# Altium schematic sheet blackfin_b_flash_jtag_serial.SchDoc: Flash, JTAG, RS-232
size A3; SheetNumber: 2; SheetTotal: 6
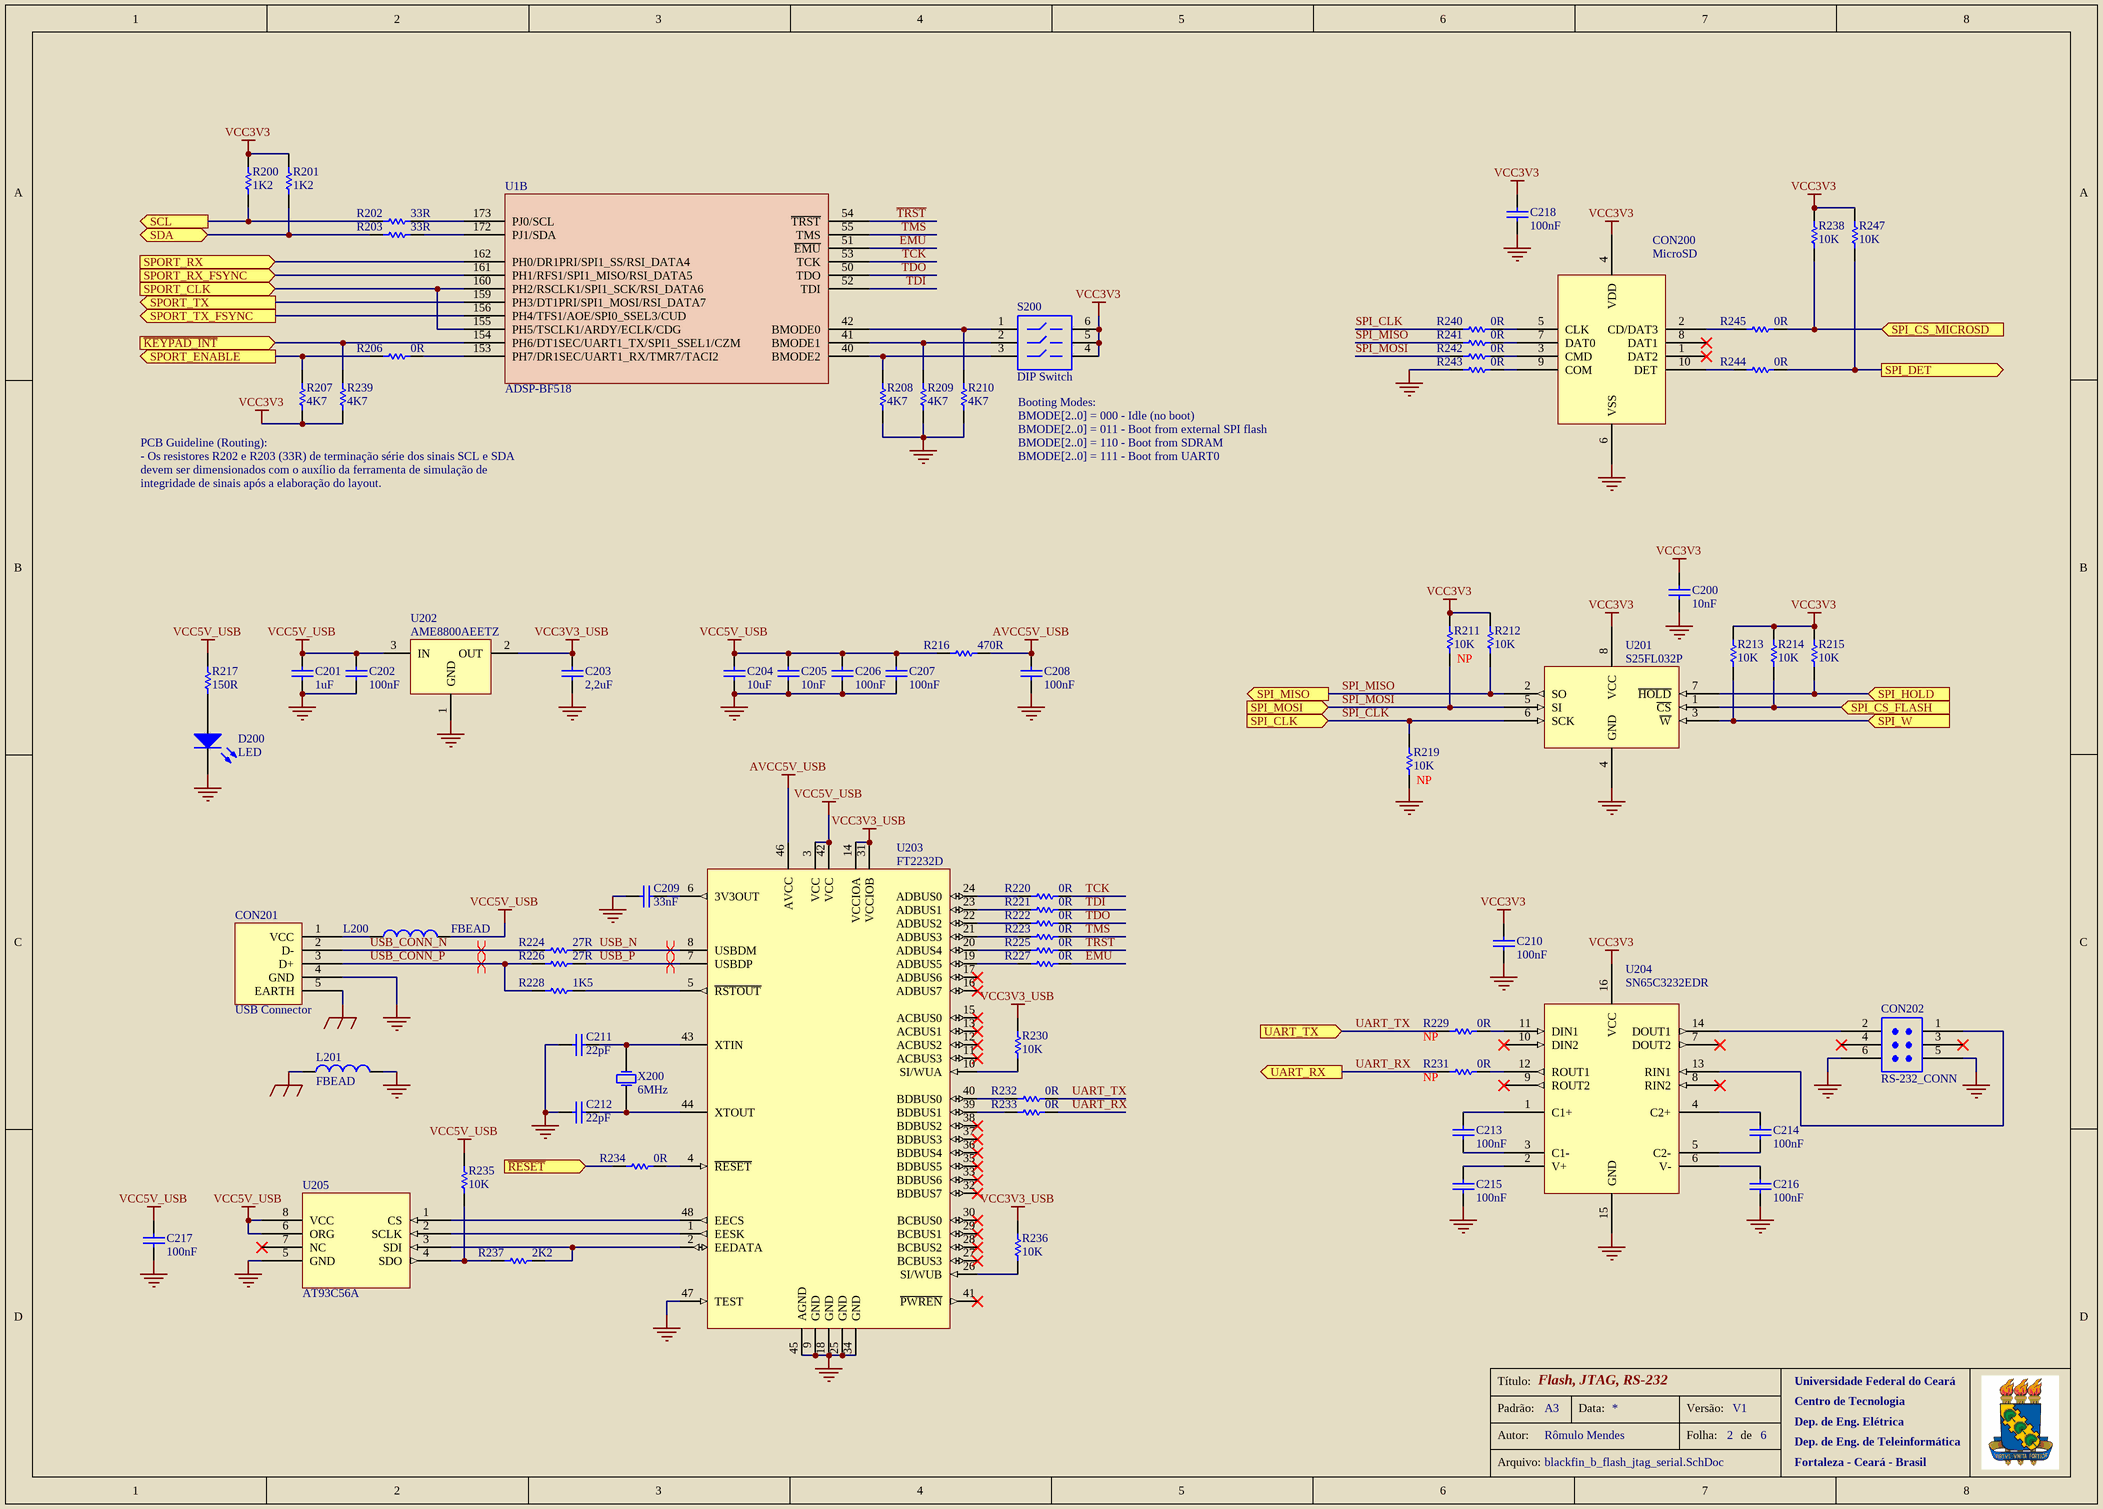
[diagram p0: blackfin_b_flash_jtag_serial.SchDoc]

## Parts
C200  10nF  [C_0603]
C201  1uF  [C_0603]
C202  100nF  [C_0603]
C203  2,2uF  [C_0603]
C204  10uF  [C_0805]
C205  10nF  [C_0603]
C206  100nF  [C_0603]
C207  100nF  [C_0603]
C208  100nF  [C_0603]
C209  33nF  [C_0603]
C210  100nF  [C_0603]
C211  22pF  [C_0603]
C212  22pF  [C_0603]
C213  100nF  [C_0603]
C214  100nF  [C_0603]
C215  100nF  [C_0603]
C216  100nF  [C_0603]
C217  100nF  [C_0603]
C218  100nF  [C_0603]
CON200  MicroSD  [MICRO_SD]
CON201  USB Connector  [USB Connector]
CON202  RS-232_CONN  [Header_2x3]
D200  LED  [LED_0603]
L200  FBEAD  [L_0603]
L201  FBEAD  [L_0603]
R200  1K2  [R_0603]
R201  1K2  [R_0603]
R202  33R  [R_0402]
R203  33R  [R_0402]
R206  0R  [R_0603]
R207  4K7  [R_0603]
R208  4K7  [R_0603]
R209  4K7  [R_0603]
R210  4K7  [R_0603]
R211  10K  [R_0603]
R212  10K  [R_0603]
R213  10K  [R_0603]
R214  10K  [R_0603]
R215  10K  [R_0603]
R216  470R  [R_0603]
R217  150R  [R_0603]
R219  10K  [R_0603]
R220  0R  [R_0603]
R221  0R  [R_0603]
R222  0R  [R_0603]
R223  0R  [R_0603]
R224  27R  [R_0603]
R225  0R  [R_0603]
R226  27R  [R_0603]
R227  0R  [R_0603]
R228  1K5  [R_0603]
R229  0R  [R_0603]
R230  10K  [R_0603]
R231  0R  [R_0603]
R232  0R  [R_0603]
R233  0R  [R_0603]
R234  0R  [R_0603]
R235  10K  [R_0603]
R236  10K  [R_0603]
R237  2K2  [R_0603]
R238  10K  [R_0603]
R239  4K7  [R_0603]
R240  0R  [R_0603]
R241  0R  [R_0603]
R242  0R  [R_0603]
R243  0R  [R_0603]
R244  0R  [R_0603]
R245  0R  [R_0603]
R247  10K  [R_0603]
S200  DIP Switch  [DIP Switch]
U1  ADSP-BF518  [LQFP-176]  (part B of 4)
U201  S25FL032P  [SO-8]
U202  AME8800AEETZ  [SOT-23]
U203  FT2232D  [LQFP-48]
U204  SN65C3232EDR  [SOIC-16]
U205  AT93C56A  [SOIC-8 (AT93C56A)]
X200  6MHz  [XTAL_6MHz]

## Ports
SCL (out), SDA (bidir), SPI_CLK (in), SPI_CS_FLASH (in), SPI_CS_MICROSD (in), SPI_DET (out), SPI_HOLD (in), SPI_MISO (out), SPI_MOSI (in), SPI_W (in), SPORT_CLK (in), SPORT_ENABLE (out), SPORT_RX (in), SPORT_RX_FSYNC (in), SPORT_TX (out), SPORT_TX_FSYNC (out), UART_RX (out), UART_TX (in), ~{KEYPAD_INT} (in), ~{RESET} (in)

## Nets
AVCC5V_USB: C208.2 R216.2 U203.46(AVCC)
EARTH_USB: CON201.5(EARTH) L201.1
GND: C200.1 C201.1 C202.1 C203.1 C204.1 C205.1 C206.1 C207.1 C208.1 C209.2 C210.1 C211.2 C212.2 C215.1 C216.1 C217.1 C218.1 CON200.6(VSS) CON201.4(GND) CON202.5(GND) CON202.6(GND) D200.2(K) L201.2 R208.1 R209.1 R210.1 R219.1 R243.1 U201.4(GND) U202.1(GND) U203.9(GND) U203.18(GND) U203.25(GND) U203.34(GND) U203.45(AGND) U203.47(TEST) U204.15(GND) U205.5(GND)
VCC3V3: C200.2 C210.2 C218.2 CON200.4(VDD) R200.2 R201.2 R207.1 R211.2 R212.2 R213.2 R214.2 R215.2 R238.2 R239.1 R247.2 S200.4 S200.5 S200.6 U201.8(VCC) U204.16(VCC)
VCC3V3_USB: C203.2 R230.1 R236.1 U202.2(OUT) U203.14(VCCIOA) U203.31(VCCIOB)
VCC5V_USB: C201.2 C202.2 C204.2 C205.2 C206.2 C207.2 C217.2 L200.2 R216.1 R217.2 R235.2 U202.3(IN) U203.3(VCC) U203.42(VCC) U205.6(ORG) U205.8(VCC)
~{EMU}: R227.2 U1.51(~{EMU})
~{KEYPAD_INT}: R239.2 U1.154(PH6/DT1SEC/UART1_TX/SPI1_SSEL1/CZM) ; port ~{KEYPAD_INT}
~{RESET}: R234.1 ; port ~{RESET}
SCL: R200.1 R202.1 ; port SCL
SDA: R201.1 R203.1 ; port SDA
SPI_CLK: R219.2 R240.1 U201.6(SCK) ; port SPI_CLK
SPI_CS_FLASH: R214.1 U201.1(~{CS}) ; port SPI_CS_FLASH
SPI_CS_MICROSD: R238.1 R245.2 ; port SPI_CS_MICROSD
SPI_DET: R244.2 R247.1 ; port SPI_DET
SPI_HOLD: R215.1 U201.7(~{HOLD}) ; port SPI_HOLD
SPI_MISO: R212.1 R241.1 U201.2(SO) ; port SPI_MISO
SPI_MOSI: R211.1 R242.1 U201.5(SI) ; port SPI_MOSI
SPI_W: R213.1 U201.3(~{W}) ; port SPI_W
SPORT_CLK: U1.155(PH5/TSCLK1/ARDY/ECLK/CDG) U1.160(PH2/RSCLK1/SPI1_SCK/RSI_DATA6) ; port SPORT_CLK
SPORT_ENABLE: R206.1 R207.2 ; port SPORT_ENABLE
SPORT_RX: U1.162(PH0/DR1PRI/SPI1_SS/RSI_DATA4) ; port SPORT_RX
SPORT_RX_FSYNC: U1.161(PH1/RFS1/SPI1_MISO/RSI_DATA5) ; port SPORT_RX_FSYNC
SPORT_TX: U1.159(PH3/DT1PRI/SPI1_MOSI/RSI_DATA7) ; port SPORT_TX
SPORT_TX_FSYNC: U1.156(PH4/TFS1/AOE/SPI0_SSEL3/CUD) ; port SPORT_TX_FSYNC
~{TRST}: R225.2 U1.54(~{TRST})
TCK: R220.2 U1.53(TCK)
TDI: R221.2 U1.52(TDI)
TDO: R222.2 U1.50(TDO)
TMS: R223.2 U1.55(TMS)
UART_RX: R231.1 R233.2 ; port UART_RX
UART_TX: R229.1 R232.2 ; port UART_TX
USB_CONN_N: CON201.2(D-) R224.1
USB_CONN_P: CON201.3(D+) R226.1 R228.1
USB_N: R224.2 U203.8(USBDM)
USB_P: R226.2 U203.7(USBDP)
NetC209_1: C209.1 U203.6(3V3OUT)
NetC211_1: C211.1 U203.43(XTIN) X200.2(OSC2)
NetC212_1: C212.1 U203.44(XTOUT) X200.1(OSC1)
NetC213_1: C213.1 U204.3(C1-)
NetC213_2: C213.2 U204.1(C1+)
NetC214_1: C214.1 U204.5(C2-)
NetC214_2: C214.2 U204.4(C2+)
NetC215_2: C215.2 U204.2(V+)
NetC216_2: C216.2 U204.6(V-)
NetCON200_2: CON200.2(CD/DAT3) R245.1
NetCON200_3: CON200.3(CMD) R242.2
NetCON200_5: CON200.5(CLK) R240.2
NetCON200_7: CON200.7(DAT0) R241.2
NetCON200_9: CON200.9(COM) R243.2
NetCON200_10: CON200.10(DET) R244.1
NetCON201_1: CON201.1(VCC) L200.1
NetCON202_1: CON202.1(TX) U204.13(RIN1)
NetCON202_2: CON202.2(RX) U204.14(DOUT1)
NetD200_1: D200.1(A) R217.1
NetR202_2: R202.2 U1.173(PJ0/SCL)
NetR203_2: R203.2 U1.172(PJ1/SDA)
NetR206_2: R206.2 U1.153(PH7/DR1SEC/UART1_RX/TMR7/TACI2)
NetR208_2: R208.2 S200.3 U1.40(BMODE2)
NetR209_2: R209.2 S200.2 U1.41(BMODE1)
NetR210_2: R210.2 S200.1 U1.42(BMODE0)
NetR220_1: R220.1 U203.24(ADBUS0)
NetR221_1: R221.1 U203.23(ADBUS1)
NetR222_1: R222.1 U203.22(ADBUS2)
NetR223_1: R223.1 U203.21(ADBUS3)
NetR225_1: R225.1 U203.20(ADBUS4)
NetR227_1: R227.1 U203.19(ADBUS5)
NetR228_2: R228.2 U203.5(~{RSTOUT})
NetR229_2: R229.2 U204.11(DIN1)
NetR230_2: R230.2 U203.10(SI/WUA)
NetR231_2: R231.2 U204.12(ROUT1)
NetR232_1: R232.1 U203.40(BDBUS0)
NetR233_1: R233.1 U203.39(BDBUS1)
NetR234_2: R234.2 U203.4(~{RESET})
NetR235_1: R235.1 R237.2 U205.4(SDO)
NetR236_2: R236.2 U203.26(SI/WUB)
NetR237_1: R237.1 U203.2(EEDATA) U205.3(SDI)
NetU203_1: U203.1(EESK) U205.2(SCLK)
NetU203_48: U203.48(EECS) U205.1(CS)

Not connected (* = marked no-connect by the designer): CON200 1(DAT2)* 8(DAT1)*; CON202 3(NC)* 4(NC)*; U203 11(ACBUS3)* 12(ACBUS2)* 13(ACBUS1)* 15(ACBUS0)* 16(ADBUS7)* 17(ADBUS6)* 27(BCBUS3)* 28(BCBUS2)* 29(BCBUS1)* 30(BCBUS0)* 32(BDBUS7)* 33(BDBUS6)* 35(BDBUS5)* 36(BDBUS4)* 37(BDBUS3)* 38(BDBUS2)* 41(~{PWREN})*; U204 7(DOUT2)* 8(RIN2)* 9(ROUT2)* 10(DIN2)*; U205 7(NC)*

## Layout directives
differential pair: USB_CONN_N, USB_CONN_P, USB_N, USB_P

## Notes on the sheet
- (near R207) PCB Guideline (Routing):
- Booting Modes:
- BMODE[2..0] = 000 - Idle (no boot)
- BMODE[2..0] = 011 - Boot from external SPI flash
- BMODE[2..0] = 110 - Boot from SDRAM
- - Os resistores R202 e R203 (33R) de terminação série dos sinais SCL e SDA
- devem ser dimensionados com o auxílio da ferramenta de simulação de
- integridade de sinais após a elaboração do layout.
- BMODE[2..0] = 111 - Boot from UART0
- (near R211) NP
- (near R219) NP
- (near R229) NP
- (near R231) NP
- Título:
- Universidade Federal do Ceará
- Padrão:
- Autor:
- A3
- Rômulo Mendes
- Data:
- Versão:
- Folha:
- V1
- de
- Centro de Tecnologia
- Dep. de Eng. Elétrica
- Dep. de Eng. de Teleinformática
- Arquivo:
- Fortaleza - Ceará - Brasil

## Library data of the parts
C200 C205 = Capacitor: eVendorPart#: 77-VJ0603Y103KXAPBC; Manufacturer: Vishay/Vitramon; Part#: VJ0603Y103KXAPW1BC; eVendor: Mouser; eVendorPrice: 0,05; MSRP: 0,013; MOQ: 1000
C201 = Capacitor: eVendorPart#: 81-GRM188F51E105ZA12; Manufacturer: Murata; Part#: GRM188F51E105ZA12D; eVendor: Mouser; eVendorPrice: 0,07; MSRP: 0,016; MOQ: 1000
C202 C206-C208 C210 C213-C218 = Capacitor: eVendorPart#: 81-GRM188R71E104KA01; Manufacturer: Murata; Part#: GRM188R71E104KA01J; eVendor: Mouser; eVendorPrice: 0,14; MSRP: 0,11; MOQ: 1000
C203 = Capacitor: eVendorPart#: 81-GRM188F51A225ZE01; Manufacturer: Murata; Part#: GRM188F51A225ZE01D; eVendor: Mouser; eVendorPrice: 0,11; MSRP: 0,024; MOQ: 1000
C204 = Capacitor: eVendorPart#: 810-C2012Y5V1C106Z; Manufacturer: TDK; Part#: C2012Y5V1C106Z; eVendor: Mouser; eVendorPrice: 0,10; MSRP: 0,05; MOQ: 1000
C209 = Capacitor: eVendorPart#: 81-GRM18B11E333KA01D; Manufacturer: Murata; Part#: GRM188B11E333KA01D; eVendor: Mouser; eVendorPrice: 0,07; MSRP: 0,013; MOQ: 1000
C211 C212 = Capacitor: eVendorPart#: 581-06035A220J; Manufacturer: AVX; Part#: 06035A220JAT2A; eVendor: Mouser; eVendorPrice: 0,03; MSRP: 0,018; MOQ: 1000
CON200 = MicroSD: Manufacturer: AVX Corporation; Part#: 045138008010890+; eVendorPart#: 478-4965-1-ND; MSRP: 2,394; eVendorPrice: 3,86; eVendor: Digikey; MOQ: 1000
CON201 = USB Connector: eVendorPart#: 649-61729-0010BLF; Manufacturer: FCI; Part#: 61729-0010BLF; eVendor: Mouser; eVendorPrice: 0,58; MSRP: 0,39; MOQ: 1000
CON202 = RS-232 Connector: Part#: 87759-0614; eVendorPart#: 538-87759-0614; Manufacturer: Molex; eVendor: Mouser; eVendorPrice: 0,62; MSRP: 0,48; MOQ: 1000
D200 = LED: Red LED; eVendorPart#: 638-QTLP600C2TR; Manufacturer: Everlight; Part#: QTLP600C2TR; eVendor: Mouser; eVendorPrice: 0,22; MSRP: 0,083; MOQ: 1000
L200 L201 = Inductor: eVendorPart#: 875-MI0603L301R-10; Manufacturer: Laird Technologies; Part#: MI0603L301R-10; eVendor: Mouser; eVendorPrice: 0,16; MSRP: 0,066; MOQ: 1000
R200 R201 = Resistor: eVendorPart#: 71-CRCW0603-1.2K-E3; Part#: CRCW06031K20FKEA; Manufacturer: Vishay/Dale; eVendor: Mouser; eVendorPrice: 0,06; MSRP: 0,015; MOQ: 1000
R202 R203 = Resistor: eVendorPart#: 71-CRCW0402J-33-E3; Part#: CRCW040233R0JNED; Manufacturer: Vishay/Dale; eVendor: Mouser; eVendorPrice: 0,06; MSRP: 0,01; MOQ: 1000
R206 R220-R223 R225 R227 R229 R231-R234 R240-R245 = Resistor: eVendorPart#: 71-CRCW06030000Z0EB; Part#: CRCW06030000Z0EB; Manufacturer: Vishay/Dale; eVendor: Mouser; eVendorPrice: 0,06; MSRP: 0,015; MOQ: 1000
R207-R210 R239 = Resistor: eVendorPart#: 71-CRCW0603J-4.7K-E3; Part#: CRCW06034K70JNEA; Manufacturer: Vishay/Dale; eVendor: Mouser; eVendorPrice: 0,06; MSRP: 0,01; MOQ: 1000
R211-R215 R219 R230 R235 R236 R238 R247 = Resistor: eVendorPart#: 71-CRCW0603-10K-E3; Part#: CRCW060310K0FKEA; Manufacturer: Vishay/Dale; eVendor: Mouser; eVendorPrice: 0,06; MSRP: 0,015; MOQ: 1000
R216 = Resistor: eVendorPart#: 71-CRCW0603-470-E3; Part#: CRCW0603470RFKEA; Manufacturer: Vishay/Dale; eVendor: Mouser; eVendorPrice: 0,06; MSRP: 0,015; MOQ: 1000
R217 = Resistor: eVendorPart#: 71-CRCW0603150RJNEB; Part#: CRCW0603150RJNEB; Manufacturer: Vishay/Dale; eVendor: Mouser; eVendorPrice: 0,06; MSRP: 0,01; MOQ: 1000
R224 R226 = Resistor: eVendorPart#: 71-CRCW0603-27-E3; Part#: CRCW060327R0FKEA; Manufacturer: Vishay/Dale; eVendor: Mouser; eVendorPrice: 0,06; MSRP: 0,015; MOQ: 1000
R228 = Resistor: eVendorPart#: 71-CRCW0603-1.5K-E3; Part#: CRCW06031K50FKEA; Manufacturer: Vishay/Dale; eVendor: Mouser; eVendorPrice: 0,06; MSRP: 0,015; MOQ: 1000
R237 = Resistor: eVendorPart#: 71-CRCW06032K20JNEB; Part#: CRCW06032K20JNEB; Manufacturer: Vishay/Dale; eVendor: Mouser; eVendorPrice: 0,06; MSRP: 0,01; MOQ: 1000
S200 = DIP Switch: eVendorPart#: 611-SDA03H1SBD; Manufacturer: C&K Components; Part#: SDA03H1SBD; eVendor: Mouser; eVendorPrice: 1,21; MSRP: 0,73; MOQ: 1000
U1 = ADSP-BF518: eVendorPart#: ADSP-BF518BSWZ-4; eVendor: Analog Devices; eVendorPrice: 13,76; MSRP: 13,07; Part#: ADSP-BF518BSWZ-4; Manufacturer: Analog Devices; MOQ: 1000
U201 = S25FL032P: Part#: S25FL032P0XMFI010; Manufacturer: Spansion; eVendor: Avnet; eVendorPrice: 1,63; MSRP: 1,61; eVendorPart#: S25FL032P0XMFI010; MOQ: 1000
U202 = AME8800AEETZ: eVendorPart#: 827-AME8800AEETZ; Manufacturer: AME; eVendor: Mouser; eVendorPrice: 0,67; MSRP: 0,171; MOQ: 1000; Part#: AME8800AEETZ
U203 = FT2232D: eVendorPart#: 895-FT2232D; Manufacturer: FTDI; eVendor: Mouser; MSRP: 3,80; eVendorPrice: 6,99; Part#: FT2232D; MOQ: 1000
U204 = RS-232 Transceiver: eVendorPart#: 595-SN65C3232EDR; Manufacturer: Texas Instruments; eVendor: Mouser; MSRP: 0,932; eVendorPrice: 1,41; Part#: SN65C3232EDR; MOQ: 1000
U205 = AT93C56A: eVendorPart#: 556-A93C56A10SU2.7; Manufacturer: Atmel; Part#: AT93C56A-10SU-2.7; eVendor: Mouser; eVendorPrice: 0,42; MSRP: 0,24; MOQ: 1000
X200 = XTAL: eVendorPart#: 774-ATS060SM-1; Part#: ATS060SM-1; Manufacturer: CTS Electronic Components; eVendor: Mouser; eVendorPrice: 0,49; MSRP: 0,23; MOQ: 1000